# Altium project squareatron.PrjPcb
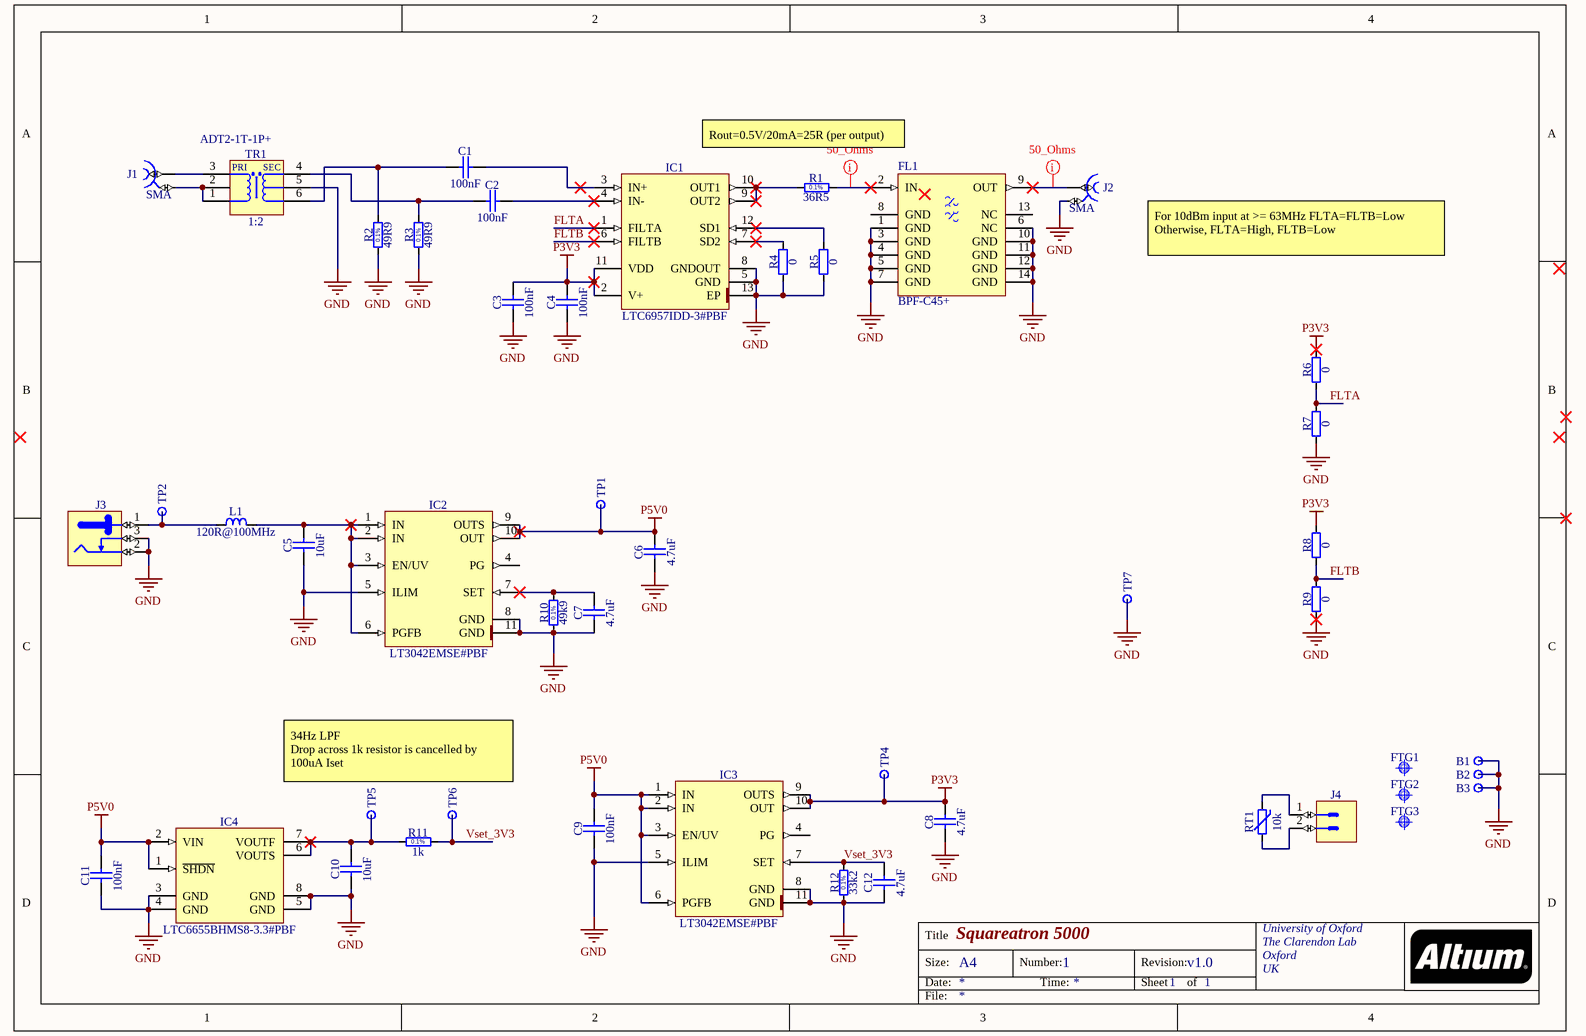
[diagram p0: squareatron.SchDoc]
1 sheet, 48 parts. Net scope: global (net labels, ports and power ports of the same name join across sheets).
Board file: squareatron.PcbDoc

## Sheet squareatron.SchDoc: Squareatron 5000
size A4; Author: Thomas Harty; CompanyName: University of Oxford; Organization: University of Oxford; Address1: The Clarendon Lab; Address2: Oxford; Address3: UK; DocumentNumber: 1; Revision: v1.0; SheetNumber: 1; SheetTotal: 1

### Parts
B1  Plated Hole  [MTG350_650]  (value not drawn)
B2  Plated Hole  [MTG350_650]  (value not drawn)
B3  Plated Hole  [MTG350_650]  (value not drawn)
C1  100nF  [CAPC1608X87N]
C2  100nF  [CAPC1608X87N]
C3  100nF  [CAPC1608X87N]
C4  100nF  [CAPC1608X87N]
C5  10uF  [CAPC3216X180N]
C6  4.7uF  [CAPC3216X180N]
C7  4.7uF  [CAPC3216X180N]
C8  4.7uF  [CAPC3216X180N]
C9  100nF  [CAPC1608X87N]
C10  10uF  [CAPC3216X180N]
C11  100nF  [CAPC1608X87N]
C12  4.7uF  [CAPC3216X180N]
FL1  BPF-C45+  [HU1186]
FTG1  Use only in PCB  [FIDUCIAL_TOP_C100-200]  (value not drawn)
FTG2  Use only in PCB  [FIDUCIAL_TOP_S100-200]  (value not drawn)
FTG3  Use only in PCB  [FIDUCIAL_TOP_S200-400]  (value not drawn)
IC1  LTC6957IDD-3#PBF  [SON45P300X300X80-13N-R175X248]
IC2  LT3042EMSE#PBF  [SOP50P490X110-11N-R168X198]
IC3  LT3042EMSE#PBF  [SOP50P490X110-11N-R168X198]
IC4  LTC6655BHMS8-3.3#PBF  [SOP65P490X110-8N]
J1  SMA  [AMPHENOL_132134]
J2  SMA  [AMPHENOL_132203]
J3  Jack  [SWITCHCRAFT_712RA]  (value not drawn)
J4  KK®  [MOLEX_22-27-2021]  (value not drawn)
L1  120R@100MHz  [INDC1608X95N]
R1  36R5  [RESC2012X60N]
R2  49R9  [RESC1608X55N]
R3  49R9  [RESC1608X55N]
R4  0  [RESC1608X55N]
R5  0  [RESC1608X55N]
R6  0  [RESC1608X55N]
R7  0  [RESC1608X55N]
R8  0  [RESC1608X55N]
R9  0  [RESC1608X55N]
R10  49k9  [RESC1608X55N]
R11  1k  [RESC1608X55N]
R12  33k2  [RESC1608X55N]
RT1  10k  [THERMC1608X90N]
TP1  Test Point  [TPS127]  (value not drawn)
TP2  Test Point  [TPS127]  (value not drawn)
TP4  Test Point  [TPS127]  (value not drawn)
TP5  Test Point  [TPS127]  (value not drawn)
TP6  Test Point  [TPS127]  (value not drawn)
TP7  Test Point  [TPS127]  (value not drawn)
TR1  1:2  Manufacturer Part Number: ADT2-1T-1P+  [XFMR_MINI-CIRCUITS_CD542]

### Nets
GND: B1.1 B2.1 B3.1 C3.1 C4.1 C5.1 C6.1 C7.1 C8.1 C9.1 C10.1 C11.1 C12.1 FL1.1(GND) FL1.3(GND) FL1.4(GND) FL1.5(GND) FL1.6(NC) FL1.7(GND) FL1.10(GND) FL1.11(GND) FL1.12(GND) FL1.14(GND) IC1.5(GND) IC1.8(GNDOUT) IC1.13(EP) IC2.5(ILIM) IC2.8(GND) IC2.11(GND) IC3.5(ILIM) IC3.8(GND) IC3.11(GND) IC4.3(GND) IC4.4(GND) IC4.5(GND) IC4.8(GND) J2.2 J3.2 J3.3 R2.1 R3.1 R4.1 R5.1 R7.1 R9.1 R10.1 R12.1 TP7.1 TR1.5(SCT)
P3V3: C3.2 C4.2 C8.2 IC1.2(V+) IC1.11(VDD) IC3.9(OUTS) IC3.10(OUT) R6.2 R8.2 TP4.1
P5V0: C6.2 C9.2 C11.2 IC2.9(OUTS) IC2.10(OUT) IC3.1(IN) IC3.2(IN) IC3.3(EN/UV) IC3.6(PGFB) IC4.1(~{SHDN}) IC4.2(VIN) TP1.1
FLTA: IC1.1(FILTA) R6.1 R7.2
FLTB: IC1.6(FILTB) R8.1 R9.2
Vset_3V3: C12.2 IC3.7(SET) R11.2 R12.2 TP6.1
NetC1_1: C1.1 R2.2 TR1.6(SDOT)
NetC1_2: C1.2 IC1.3(IN+)
NetC2_1: C2.1 R3.2 TR1.4(S)
NetC2_2: C2.2 IC1.4(IN-)
NetC5_2: C5.2 IC2.1(IN) IC2.2(IN) IC2.3(EN/UV) IC2.6(PGFB) L1.2
NetC7_2: C7.2 IC2.7(SET) R10.2
NetC10_2: C10.2 IC4.6(VOUTS) IC4.7(VOUTF) R11.1 TP5.1
NetFL1_2: FL1.2(IN) R1.2
NetFL1_9: FL1.9(OUT) J2.1
NetIC1_7: IC1.7(SD2) R4.2
NetIC1_9: IC1.9(OUT2) IC1.10(OUT1) R1.1
NetIC1_12: IC1.12(SD1) R5.2
NetJ1_1: J1.1 TR1.3(PDOT)
NetJ1_2: J1.2 TR1.1(P) TR1.2(NC)
NetJ3_1: J3.1 L1.1 TP2.1
NetJ4_1: J4.1 RT1.2
NetJ4_2: J4.2 RT1.1

Not connected (* = marked no-connect by the designer): FL1 8(GND) 13(NC); IC2 4(PG); IC3 4(PG)

### Layout directives
net class 50_Ohms: NetFL1_2, NetFL1_9

### Notes on the sheet
- Rout=0.5V/20mA=25R (per output)
- For 10dBm input at >= 63MHz FLTA=FLTB=Low
  Otherwise, FLTA=High, FLTB=Low
- 34Hz LPF
  Drop across 1k resistor is cancelled by 100uA Iset
- Title
- Size:
- Date:
- A4
- Number:
- Time:
- Revision:
- Sheet
- of
- File:
- (in symbol R0603_1K_0.1%_0.063W_10PPM) 0.1%
- (in symbol R0603_33K2_0.1%_0.063W_10PPM) 0.1%
- (in symbol R0603_49K9_0.1%_0.063W_10PPM) 0.1%
- (in symbol R0603_49R9_0.1%_0.063W_10PPM) 0.1%
- (in symbol R0805_36R5_0.1%_0.1W_10PPM) 0.1%
- (in symbol XFMR_MINI-CIRCUITS_ADT2-1T-1P+) PRI; SEC

### Library data of the parts
B1-B3 = PLATED_HOLE3.5_PAD6.5: Single Terminal Socket; Part Description: Plated Through Hole: Hole Dia.=3.5mm Pad Dia.=6.5mm; Mounted: No; Part Number: PLATED_HOLE3.5_PAD6.5; Component Kind: Standard (No BOM); Component Type: Standard (No BOM); Pin Count: 1; Family: Plated Hole; Socket: No; SMD: No; Sense: No; Status: None; ComponentHeight: 0mm; HelpURL: Undefined; Author: CERN DEM JLC; CreateDate: 20/11/2008; LatestRevisionDate: 23/11/2011; PackageDescription: Plated Through Hole: Hole Dia.=3.5mm Pad Dia.=6.5mm
C1-C4 C9 C11 = CC0603_100NF_50V_10%_X7R: Non-polarised capacitor; Part Description: SMD Multilayer Chip Ceramic Capacitor; Manufacturer: GENERIC; Manufacturer1 Part Number: 223858615649; Voltage: 50V; TC: X7R; Tolerance: ±10%; Part Number: CC0603_100NF_50V_10%_X7R; Component Kind: Standard; Component Type: Standard; Pin Count: 2; Value: 100nF; Status: Preferred; Manufacturer Part Number: CC0603_100NF_50V_10%_X7R; Case: 0603; Mounted: Yes; Socket: No; SMD: Yes; Sense: No; Manufacturer1 Example: PHYCOMP; Manufacturer1 ComponentHeight: 0.87mm; HelpURL: \\cern.ch\dfs\Applications\Altium\Datasheets\CC0603_X7R_PHYCOMP.pdf; Author: CERN DEM JLC; CreateDate: 03/12/2007; LatestRevisionDate: 03/12/2007
C5 C10 = CC1206_10UF_25V_10%_X7R: Non-polarised capacitor; Part Description: SMD Multilayer Chip Ceramic Capacitor; Manufacturer: GENERIC; Manufacturer1 Part Number: C1206C106K4RACTU; Voltage: 25V; TC: X7R; Tolerance: ±10%; Part Number: CC1206_10UF_25V_10%_X7R; Component Kind: Standard; Component Type: Standard; Pin Count: 2; Value: 10uF; Status: Preferred; Manufacturer Part Number: CC1206_10uF_25V_10%_X7R; Case: 1206; Mounted: Yes; Socket: No; SMD: Yes; Sense: No; Manufacturer1 Example: KEMET; Manufacturer1 ComponentHeight: 1.8mm; HelpURL: \\cern.ch\dfs\Applications\Altium\Datasheets\CC1206_X7R_KEMET.pdf; Author: CERN DEM JLC; CreateDate: 12/09/2012; LatestRevisionDate: 12/09/2012
C6-C8 C12 = CC1206_4.7UF_16V_10%_X5R: Non-polarised capacitor; Part Description: SMD Multilayer Chip Ceramic Capacitor; Manufacturer: GENERIC; Manufacturer1 Part Number: C1206C475K4PAC; Voltage: 16V; TC: X5R; Tolerance: ±10%; Part Number: CC1206_4.7UF_16V_10%_X5R; Component Kind: Standard; Component Type: Standard; Pin Count: 2; Value: 4.7uF; Status: Preferred; Manufacturer Part Number: CC1206_4.7UF_16V_10%_X5R; Case: 1206; Mounted: Yes; Socket: No; SMD: Yes; Sense: No; Manufacturer1 Example: KEMET; Manufacturer1 ComponentHeight: 1.8mm; HelpURL: \\cern.ch\dfs\Applications\Altium\Datasheets\CC1206_X5R_KEMET.pdf; Author: CERN DEM JLC; CreateDate: 03/12/2007; LatestRevisionDate: 03/12/2007
FL1 = BPF-C45+: 50 Ohm 30MHz to 70MHz Low Pass Filter; Manufacturer: MINI-CIRCUITS; value: BPF-C45+; Manufacturer Part Number: BPF-C45+
FTG1 = FIDUCIAL_TARGET_C100-200: Fiducial Target; Part Description: Round Fiducial Target, Top Layer, 1.0mm, Top Solder 2.0mm, Keepout =2.0mm; Mounted: No; Part Number: FIDUCIAL_TARGET_C100-200; Component Kind: Standard (No BOM); Component Type: Standard (No BOM); Pin Count: 1; Family: Fiducial; Socket: No; SMD: Yes; Sense: No; Status: None; ComponentHeight: 0mm; HelpURL: Undefined; Author: CERN DEM JLC; CreateDate: 09.02.2010; LatestRevisionDate: 04.04.2012; PackageDescription: Round Fiducial Target, Top Layer, 1.0mm, Top Solder 2.0mm, Keepout =2.0mm
FTG2 = FIDUCIAL_TARGET_S100-200: Fiducial Target; Part Description: Square Fiducial Target, Top Layer, 1.0mm, Top Solder 2.0mm, Keepout =2.0mm; Mounted: No; Part Number: FIDUCIAL_TARGET_S100-200; Component Kind: Standard (No BOM); Component Type: Standard (No BOM); Pin Count: 1; Family: Fiducial; Socket: No; SMD: Yes; Sense: No; Status: None; ComponentHeight: 0mm; HelpURL: Undefined; Author: CERN DEM JLC; CreateDate: 09.02.2010; LatestRevisionDate: 04.04.2012; PackageDescription: Square Fiducial Target, Top Layer, 1.0mm, Top Solder 2.0mm, Keepout =2.0mm
FTG3 = FIDUCIAL_TARGET_S200-400: Fiducial Target; Part Description: Square Fiducial Target, Top Layer, 2.0mm, Top Solder 4.0mm, Keepout =4.0mm; Mounted: No; Part Number: FIDUCIAL_TARGET_S200-400; Component Kind: Standard (No BOM); Component Type: Standard (No BOM); Pin Count: 1; Family: Fiducial; Socket: No; SMD: Yes; Sense: No; Status: None; ComponentHeight: 0mm; HelpURL: Undefined; Author: CERN DEM JLC; CreateDate: 02.06.2008; LatestRevisionDate: 04.04.2012; PackageDescription: Square Fiducial Target, Top Layer, 2.0mm, Top Solder 4.0mm, Keepout =4.0mm
IC1 = LTC6957IDD-3#PBF: Low Phase Noise, Dual Output Buffer/Driver/Logic Converter, CMOS Logic, In-Phase Outputs; Manufacturer: LINEAR TECHNOLOGY; PressFit: No; Bonding: No; Part Number: LTC6957IDD-3#PBF; Component Kind: Standard; Component Type: Standard; Device: LTC6957IDD-3#PBF; PackageDescription: SON, 0.45mm Pitch; 12 Pin, 3.00mm W X 3.00mm L X 0.80mm H Body (w/Thermal tab 1.75 x 2.48mm), IPC Medium Density; Part Description: Low Phase Noise, Dual Output Buffer/Driver/Logic Converter, CMOS Logic, In-Phase Outputs; Manufacturer Part Number: LTC6957IDD-3#PBF; Pin Count: 13; Case: SON12; Mounted: Yes; Socket: No; SMD: Yes; Sense: No; ComponentHeight: 0.8mm; Author: CERN DEM JMW; HelpURL: \\cern.ch\dfs\Applications\Altium\Datasheets\LTC6957IDD-3#PBF.pdf; CreateDate: 08/08/2016; LatestRevisionDate: 07/12/2016
IC2 IC3 = LT3042EMSE#PBF: 20V, 200mA, Ultralow Noise, Ultrahigh PSRR RF Linear Regulator; Manufacturer: LINEAR TECHNOLOGY; PressFit: No; Bonding: No; Part Number: LT3042EMSE#PBF; Component Kind: Standard; Component Type: Standard; Device: LT3042EMSE#PBF; PackageDescription: SOP, 0.50mm, Pitch; 10 pin, 3.00mm W X 3.00mm L X 1.10mm H body (w/thermal tab  1.68 X 1.98 mm), IPC Medium Density; Part Description: 20V, 200mA, Ultralow Noise, Ultrahigh PSRR RF Linear Regulator; Manufacturer Part Number: LT3042EMSE#PBF; Pin Count: 11; Case: MSOP10; Mounted: Yes; Socket: No; SMD: Yes; Sense: No; ComponentHeight: 1.1mm; HelpURL: \\cern.ch\dfs\Applications\Altium\Datasheets\LT3042EMSE#PBF.pdf; Author: CERN DEM MR; CreateDate: 09/06/2016; LatestRevisionDate: 09/06/2016
IC4 = LTC6655BHMS8-3.3#PBF: 0.25ppm Noise, Low Drift Precision Buffered Voltage Reference; Part Description: 3V3, 0.25ppm Noise, Low Drift Precision Buffered Voltage Reference; Manufacturer: LINEAR TECHNOLOGY; PressFit: No; Bonding: No; Part Number: LTC6655BHMS8-3.3#PBF; Component Kind: Standard; Component Type: Standard; Device: LTC6655BHMS8-3.3#PBF; PackageDescription: SOP, 8-Leads, Body 3.1x3.1mm (max), Pitch 0.65mm, IPC Medium Density; Manufacturer Part Number: LTC6655BHMS8-3.3#PBF; Pin Count: 8; Case: SSOP8; Mounted: Yes; Socket: No; SMD: Yes; Sense: No; ComponentHeight: 1.1mm; HelpURL: \\cern.ch\dfs\Applications\Altium\Datasheets\LTC6655BHMS8-3.3#PBF.pdf; Author: CERN DEM BC; CreateDate: 03/03/2016; LatestRevisionDate: 22/11/2016
J1 = AMPHENOL_132134: Part Description: 50 Ohm Through Hole SMA Straight PCB Jack; Manufacturer Part Number: 132134; PressFit: No; Part Number: AMPHENOL_132134; Component Kind: Standard; Component Type: Standard; Pin Count: 4; Family: SMA; Mounted: Yes; Socket: No; SMD: No; Sense: No; Status: None; Manufacturer: AMPHENOL; ComponentHeight: 9.53mm; HelpURL: \\cern.ch\dfs\Applications\Altium\Datasheets\AMPHENOL_132134.pdf; Author: CERN DEM JLC; CreateDate: 16/12/2013; LatestRevisionDate: 16/12/2013
J2 = AMPHENOL_132203: Part Description: 50 Ohm Through Hole SMA Right Angle PCB Jack; Manufacturer Part Number: 132203; PressFit: No; Part Number: AMPHENOL_132203; Component Kind: Standard; Component Type: Standard; Pin Count: 5; Family: SMA; Mounted: Yes; Socket: No; SMD: No; Sense: No; Status: None; Manufacturer: AMPHENOL; ComponentHeight: 10.44mm; HelpURL: \\cern.ch\dfs\Applications\Altium\Datasheets\AMPHENOL_132203.pdf; Author: CERN DEM MR; CreateDate: 06/10/2016; LatestRevisionDate: 06/10/2016
J3 = SWITCHCRAFT_712RA: 2.5 mm Center Pin, 5A, 48V, Right Angle, Through Hole, , DC Power Jack Connector; Part Description: 2.5 mm Center Pin, 5A, 48VDC, Right Angle, Through Hole, Locking Power Jack Connector (Threaded Bushings); Manufacturer Part Number: 712RA; PressFit: No; Part Number: SWITCHCRAFT_712RA; Component Kind: Standard; Component Type: Standard; Pin Count: 3; Family: Jack; Mounted: Yes; Socket: No; SMD: No; Sense: No; Status: None; Manufacturer: SWITCHCRAFT; ComponentHeight: 13.8mm; HelpURL: \\cern.ch\dfs\Applications\Altium\Datasheets\SWITCHCRAFT_712RA.pdf; Author: CERN DEM JLC; CreateDate: 19/12/2017; LatestRevisionDate: 19/12/2017
J4 = MOLEX_22-27-2021: Connector 2 Male; Part Description: 2.54mm (.100") Pitch KK® Wire-to-Board Header, Vertical, with Friction Lock, 2 Circuits, Tin (Sn) Plating; Manufacturer: MOLEX; PressFit: No; Part Number: MOLEX_22-27-2021; Component Kind: Standard; Component Type: Standard; Pin Count: 2; Family: KK®; Mounted: Yes; Socket: No; SMD: No; Sense: No; Status: None; Manufacturer Part Number: 22-27-2021; ComponentHeight: 11.7mm; HelpURL: \\cern.ch\dfs\Applications\Altium\Datasheets\MOLEX_22-27-2021.pdf; Author: CERN DEM JLC; CreateDate: 04/12/2008; LatestRevisionDate: 04/12/2008
L1 = IND0603_MURATA_BLM18PG121SN1D: Inductor; Part Description: SMD EMIFIL Chip Ferrite Bead; Manufacturer: MURATA; Power: 2A; Resistance: 0.05R; Part Number: IND0603_MURATA_BLM18PG121SN1D; Component Kind: Standard; Component Type: Standard; Pin Count: 2; Value: 120R@100MHz; Status: None; Manufacturer Part Number: BLM18PG121SN1D; Case: 0603; Mounted: Yes; Socket: No; SMD: Yes; Sense: No; ComponentHeight: 0.95mm; HelpURL: \\cern.ch\dfs\Applications\Altium\Datasheets\IND0603_MURATA_BLM18P.pdf; Author: CERN DEM BC; CreateDate: 27/07/2015; LatestRevisionDate: 27/07/2015
R1 = R0805_36R5_0.1%_0.1W_10PPM: Resistor - 0.1%; Part Description: Thin Film Chip Resistor; Manufacturer: GENERIC; Manufacturer1 Part Number: RN73C2A36R5BTG; Power: 0.1W; TC: ±10ppm; PressFit: No; Part Number: R0805_36R5_0.1%_0.1W_10PPM; Component Kind: Standard; Component Type: Standard; Pin Count: 2; Value: 36R5; Status: Not Recommended; Tolerance: ±0.1%; Manufacturer Part Number: R0805_36R5_0.1%_0.1W_10PPM; Case: 0805; Mounted: Yes; Sense: No; Socket: No; SMD: Yes; Manufacturer1 Example: TYCO HOLSWORTHY; Manufacturer1 ComponentHeight: 0.6mm; HelpURL: \\cern.ch\dfs\Applications\Altium\Datasheets\R0805_Tyco_RN73.pdf; Author: CERN DEM JLC; CreateDate: 03/12/2007; LatestRevisionDate: 13/03/2008
R2 R3 = R0603_49R9_0.1%_0.063W_10PPM: Resistor - 0.1%; Part Description: Thin Film Chip Resistor; Manufacturer: GENERIC; Manufacturer1 Part Number: RN73C1J49R9BTDF; Power: 0.063W; TC: ±10ppm; PressFit: No; Part Number: R0603_49R9_0.1%_0.063W_10PPM; Component Kind: Standard; Component Type: Standard; Pin Count: 2; Value: 49R9; Status: Not Recommended; Tolerance: ±0.1%; Manufacturer Part Number: R0603_49R9_0.1%_0.063W_10PPM; Case: 0603; Mounted: Yes; Sense: No; Socket: No; SMD: Yes; Manufacturer1 Example: TYCO HOLSWORTHY; Manufacturer1 ComponentHeight: 0.5mm; HelpURL: \\cern.ch\dfs\Applications\Altium\Datasheets\R0603_Tyco_RN73.pdf; Author: CERN DEM JLC; CreateDate: 03/12/2007; LatestRevisionDate: 13/03/2008
R4 R5 R7-R9 = R0603_0R_JUMPER: Resistor; Part Description: 1A (0.05R Max DC Resistance) Zero Ohm Jumper; Manufacturer: GENERIC; Manufacturer1 Part Number: NRC06Z0; PressFit: No; Part Number: R0603_0R_JUMPER; Component Kind: Standard; Component Type: Standard; Pin Count: 2; Value: 0; Status: Preferred; Manufacturer Part Number: R0603_0R_JUMPER; Case: 0603; Mounted: Yes; Sense: No; Socket: No; SMD: Yes; Manufacturer1 Example: NIC COMPONENT; Manufacturer1 ComponentHeight: 0.55mm; HelpURL: \\cern.ch\dfs\Applications\Altium\Datasheets\R0603_NIC_NRC.pdf; Author: CERN DEM JLC; CreateDate: 03/12/2007; LatestRevisionDate: 13/03/2008
R6 = R0603_0R_JUMPER: Resistor; Part Description: 1A (0.05R Max DC Resistance) Zero Ohm Jumper; Manufacturer: GENERIC; Manufacturer1 Part Number: NRC06Z0; PressFit: No; Mounted: No; Part Number: R0603_0R_JUMPER; Component Kind: Standard; Component Type: Standard; Pin Count: 2; Value: 0; Status: Preferred; Manufacturer Part Number: R0603_0R_JUMPER; Case: 0603; Sense: No; Socket: No; SMD: Yes; Manufacturer1 Example: NIC COMPONENT; Manufacturer1 ComponentHeight: 0.55mm; HelpURL: \\cern.ch\dfs\Applications\Altium\Datasheets\R0603_NIC_NRC.pdf; Author: CERN DEM JLC; CreateDate: 03/12/2007; LatestRevisionDate: 13/03/2008
R10 = R0603_49K9_0.1%_0.063W_10PPM: Resistor - 0.1%; Part Description: Thin Film Chip Resistor; Manufacturer: GENERIC; Manufacturer1 Part Number: RN73C1J49K9BTDF; Power: 0.063W; TC: ±10ppm; PressFit: No; Part Number: R0603_49K9_0.1%_0.063W_10PPM; Component Kind: Standard; Component Type: Standard; Pin Count: 2; Value: 49k9; Status: Not Recommended; Tolerance: ±0.1%; Manufacturer Part Number: R0603_49K9_0.1%_0.063W_10PPM; Case: 0603; Mounted: Yes; Sense: No; Socket: No; SMD: Yes; Manufacturer1 Example: TYCO HOLSWORTHY; Manufacturer1 ComponentHeight: 0.5mm; HelpURL: \\cern.ch\dfs\Applications\Altium\Datasheets\R0603_Tyco_RN73.pdf; Author: CERN DEM JLC; CreateDate: 03/12/2007; LatestRevisionDate: 13/03/2008
R11 = R0603_1K_0.1%_0.063W_10PPM: Resistor - 0.1%; Part Description: Thin Film Chip Resistor; Manufacturer: GENERIC; Manufacturer1 Part Number: RN73C1J1K0BTG; Power: 0.063W; TC: ±10ppm; PressFit: No; Part Number: R0603_1K_0.1%_0.063W_10PPM; Component Kind: Standard; Component Type: Standard; Pin Count: 2; Value: 1k; Status: Not Recommended; Tolerance: ±0.1%; Manufacturer Part Number: R0603_1K_0.1%_0.063W_10PPM; Case: 0603; Mounted: Yes; Sense: No; Socket: No; SMD: Yes; Manufacturer1 Example: TYCO HOLSWORTHY; Manufacturer1 ComponentHeight: 0.55mm; HelpURL: \\cern.ch\dfs\Applications\Altium\Datasheets\R0603_Tyco_RN73.pdf; Author: CERN DEM BC; CreateDate: 23/05/2016; LatestRevisionDate: 23/05/2016
R12 = R0603_33K2_0.1%_0.063W_10PPM: Resistor - 0.1%; Part Description: Thin Film Chip Resistor; Manufacturer: GENERIC; Manufacturer1 Part Number: RN73C1J33K2BTDF; Power: 0.063W; TC: ±10ppm; PressFit: No; Part Number: R0603_33K2_0.1%_0.063W_10PPM; Component Kind: Standard; Component Type: Standard; Pin Count: 2; Value: 33k2; Status: Not Recommended; Tolerance: ±0.1%; Manufacturer Part Number: R0603_33K2_0.1%_0.063W_10PPM; Case: 0603; Mounted: Yes; Sense: No; Socket: No; SMD: Yes; Manufacturer1 Example: TYCO HOLSWORTHY; Manufacturer1 ComponentHeight: 0.5mm; HelpURL: \\cern.ch\dfs\Applications\Altium\Datasheets\R0603_Tyco_RN73.pdf; Author: CERN DEM JLC; CreateDate: 03/12/2007; LatestRevisionDate: 13/03/2008
RT1 = THERM_NTC_10K_EPCOS_B57330V2103J260: Thermistor NTC (Negative Temperature Coefficient); Part Description: SMD NTC Thermistor for Temperature Measurement; Manufacturer: EPCOS; Power: 180mW; Tolerance: ±5%; Part Number: THERM_NTC_10K_EPCOS_B57330V2103J260; Component Kind: Standard; Component Type: Standard; Pin Count: 2; Value: 10k; Status: None; Manufacturer Part Number: B57330V2103J260; Case: 0603; Mounted: Yes; Socket: No; SMD: Yes; Sense: No; ComponentHeight: 0.9mm; HelpURL: \\cern.ch\dfs\Applications\Altium\Datasheets\THERM_EPCOS_B573xxV2.pdf; Author: CERN DEM BC; CreateDate: 30/07/2015; LatestRevisionDate: 30/07/2015
TP1 TP2 TP4-TP7 = SMD_PAD_1.27X1.27MM: Part Description: 1.27mm x 1.27mm PCB Copper Area (SMD Test Point); Mounted: No; Part Number: SMD_PAD_1.27X1.27MM; Component Kind: Standard (No BOM); Component Type: Standard (No BOM); Pin Count: 1; Family: Test Point; Socket: No; SMD: Yes; Sense: No; Status: None; ComponentHeight: 0mm; HelpURL: Undefined; Author: CERN DEM JLC; CreateDate: 12/01/2008; LatestRevisionDate: 12/01/2008; PackageDescription: 1.27mm x 1.27mm PCB Copper Area (SMD Test Point)
TR1 = XFMR_MINI-CIRCUITS_ADT2-1T-1P+: 50 Ohms 8 To 600MHz RF Transformer; Part Number: XFMR_MINI-CIRCUITS_ADT2-1T-1P+; Component Kind: Standard; Component Type: Standard; Pin Count: 6; Value: 1:2; Status: None; Part Description: 50 Ohms 8 To 600MHz RF Transformer; Manufacturer: MINI-CIRCUITS; Mounted: Yes; Socket: No; Sense: No; SMD: Yes; ComponentHeight: 2.84mm; HelpURL: \\cern.ch\dfs\Applications\Altium\Datasheets\XFMR_MINI-CIRCUITS_ADT2-1T-1P+.pdf; Author: CERN DEM MR; CreateDate: 06/09/2017; LatestRevisionDate: 06/09/2017

## Assembly variants
default: not fitted R6 R8